# Altium schematic sheet [05] - Slow Control.SchDoc
size A3; Address1: III. Physikalisches Institut B; Address2: RWTH Aachen University; Address3: Otto-Blumenthal-Strasse; Address4: 52074 Aachen, GERMANY; DocumentNumber: 6; SheetNumber: 6; SheetTotal: 6
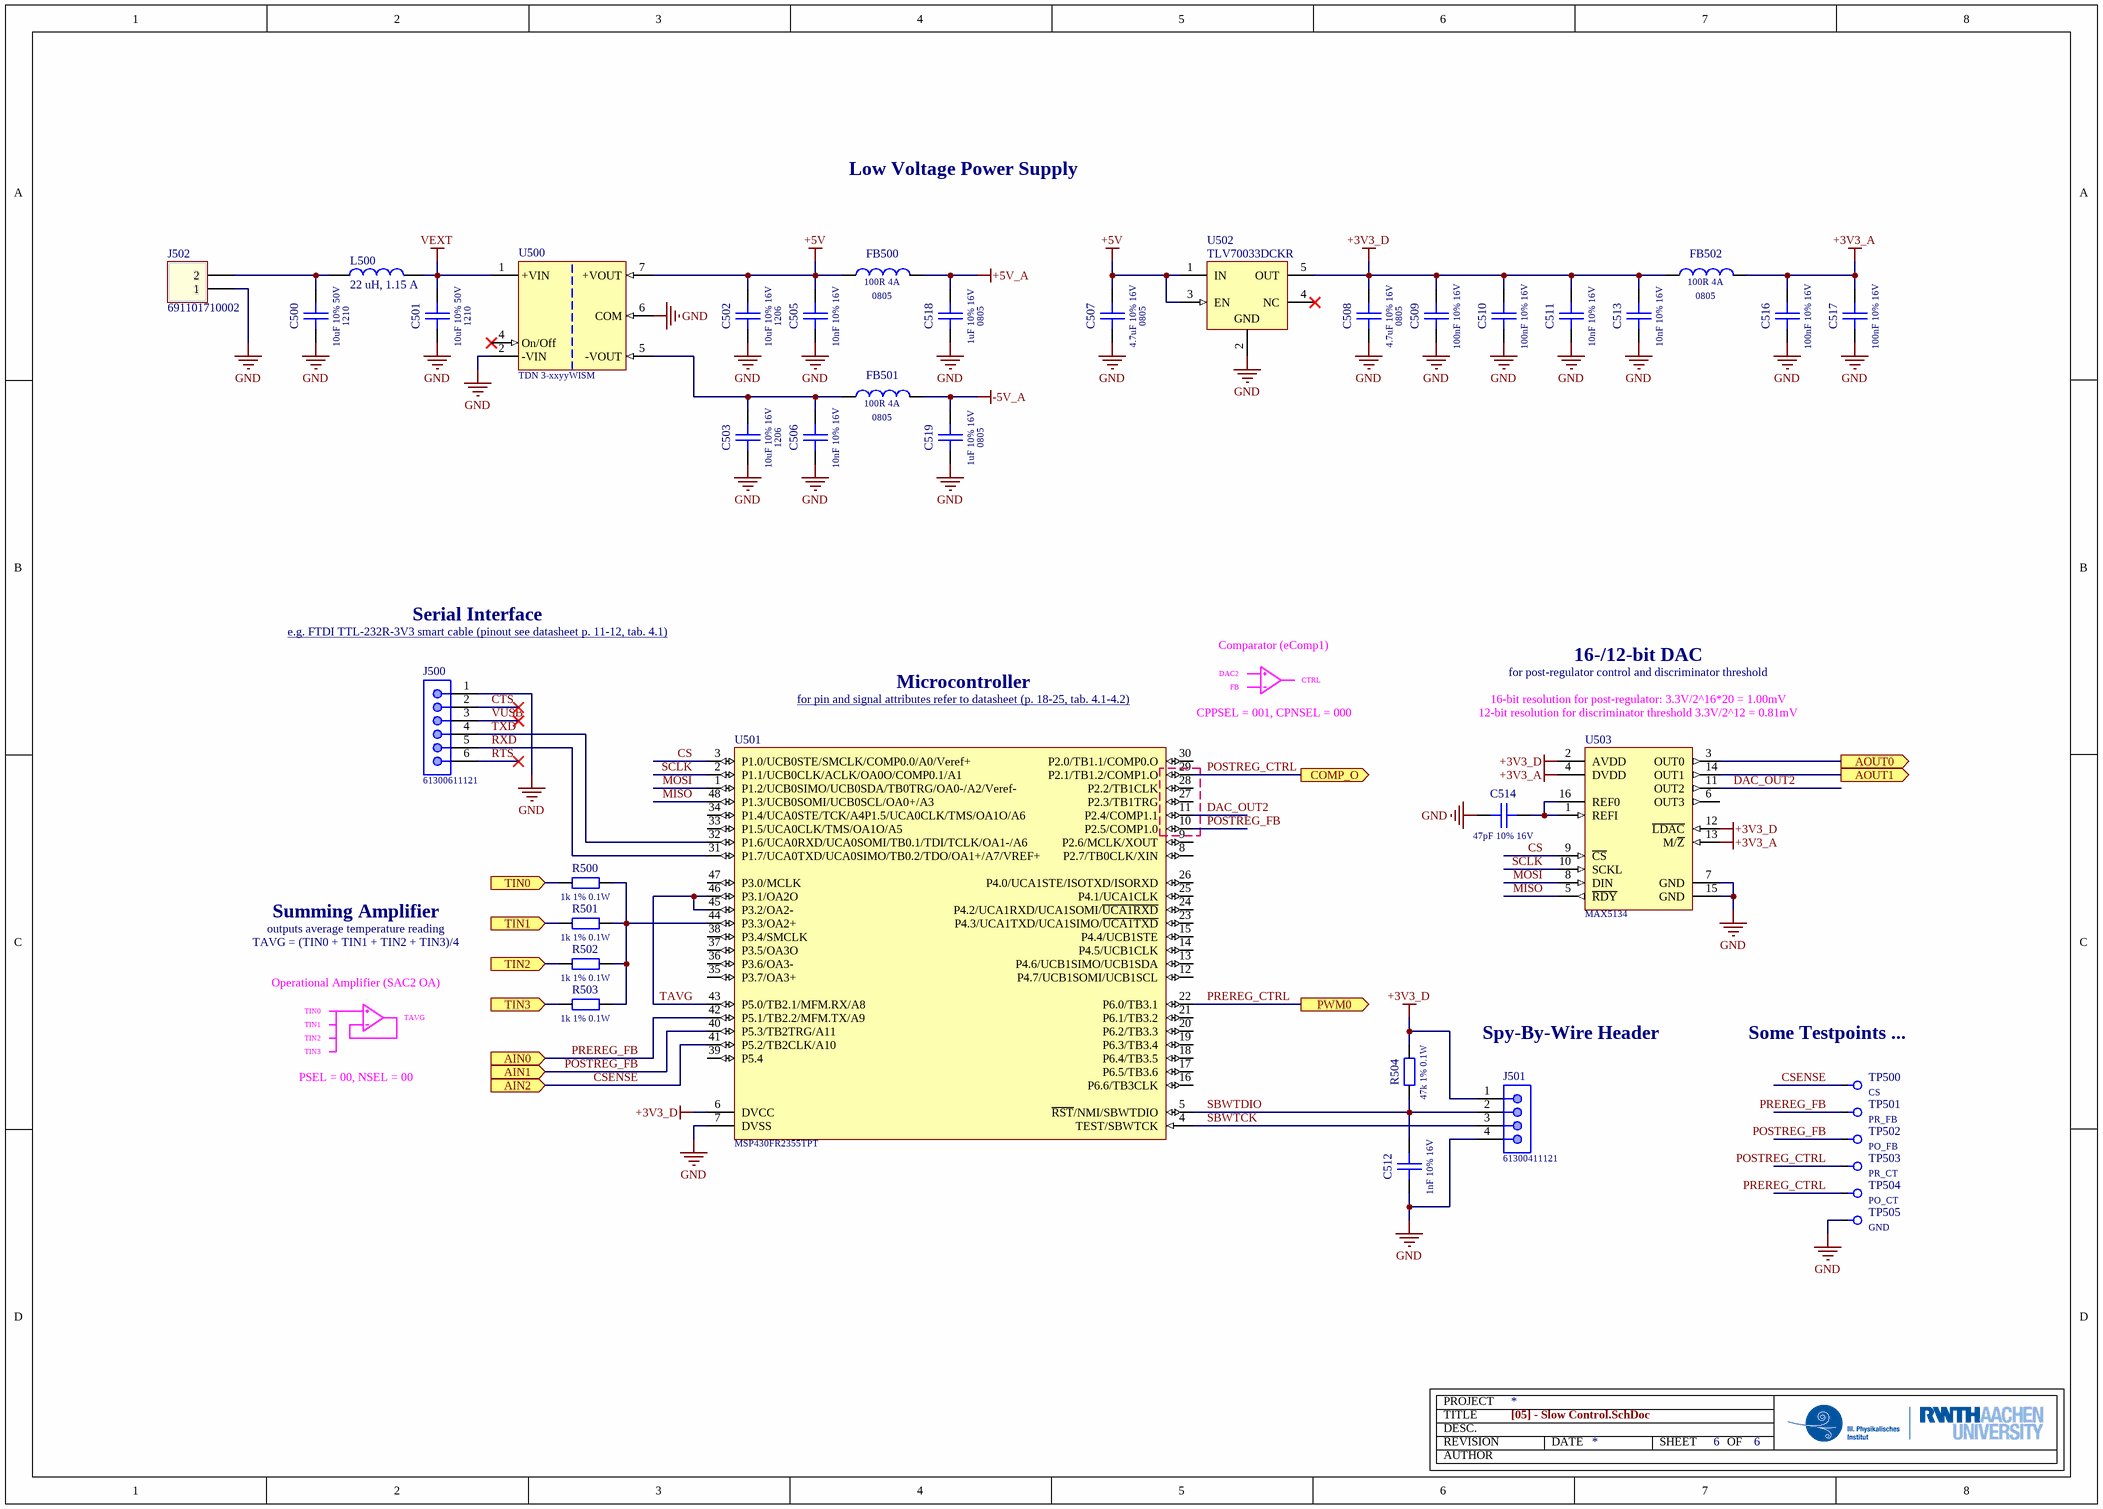
[diagram p0: [05] - Slow Control.SchDoc]

## Parts
C500  PackageReference: 1210  [1210_CAP]  (hidden comment: 10uF 10% 50V)
C501  PackageReference: 1210  [1210_CAP]  (hidden comment: 10uF 10% 50V)
C502  PackageReference: 1206  [1206_CAP]  (hidden comment: 10uF 10% 16V)
C503  PackageReference: 1206  [1206_CAP]  (hidden comment: 10uF 10% 16V)
C505  10nF 10% 16V  [0603_CAP]
C506  10nF 10% 16V  [0603_CAP]
C507  PackageReference: 0805  [0805_CAP]  (hidden comment: 4.7uF 10% 16V)
C508  PackageReference: 0805  [0805_CAP]  (hidden comment: 4.7uF 10% 16V)
C509  100nF 10% 16V  [0603_CAP]
C510  100nF 10% 16V  [0603_CAP]
C511  10nF 10% 16V  [0603_CAP]
C512  1nF 10% 16V  [0603_CAP]
C513  10nF 10% 16V  [0603_CAP]
C514  47pF 10% 16V  [0603_CAP]
C516  100nF 10% 16V  [0603_CAP]
C517  100nF 10% 16V  [0603_CAP]
C518  PackageReference: 0805  [0805_CAP]  (hidden comment: 1uF 10% 16V)
C519  PackageReference: 0805  [0805_CAP]  (hidden comment: 1uF 10% 16V)
FB500  PackageReference: 0805  [0805_RES]  (hidden comment: 100R 4A)
FB501  PackageReference: 0805  [0805_RES]  (hidden comment: 100R 4A)
FB502  PackageReference: 0805  [0603_RES]  (hidden comment: 100R 4A)
J500  61300611121  [61300611121]
J501  61300411121  [61300411121]
J502  691101710002  [691101710002]
L500  22 uH, 1.15 A  [WE-TPC_5828]
R500  1k 1% 0.1W  [0603_RES]
R501  1k 1% 0.1W  [0603_RES]
R502  1k 1% 0.1W  [0603_RES]
R503  1k 1% 0.1W  [0603_RES]
R504  47k 1% 0.1W  [0603_RES]
TP500  CS  [TESTPOINT_5019]
TP501  PR_FB  [TESTPOINT_5019]
TP502  PO_FB  [TESTPOINT_5019]
TP503  PR_CT  [TESTPOINT_5019]
TP504  PO_CT  [TESTPOINT_5019]
TP505  GND  [TESTPOINT_5019]
U500  TDN 3-xxyyWISM  [TDN_3WISM-PACK]
U501  MSP430FR2355TPT  [PQFP-48]
U502  TLV70033DCKR  [TI-DCK5_V]
U503  MAX5134  [TSSOP-16]

## Ports
AIN0 (in), AIN1 (in), AIN2 (in), AOUT0 (out), AOUT1 (out), COMP_O (out), PWM0 (out), TIN0 (in), TIN1 (in), TIN2 (in), TIN3 (in)

## Nets
+3V3_A: C516.2 C517.2 FB502.2 U503.4(DVDD) U503.13(M/~{Z})
+3V3_D: C508.2 C509.2 C510.2 C511.2 C513.2 FB502.1 J501.1 R504.1 U501.6(DVCC) U502.5(OUT) U503.2(AVDD) U503.12(~{LDAC})
+5V: C502.2 C505.2 C507.2 FB500.1 U500.7(+VOUT) U502.1(IN) U502.3(EN)
+5V_A: C518.2 FB500.2
-5V_A: C519.2 FB501.2
GND: C500.1 C501.1 C502.1 C503.1 C505.1 C506.1 C507.1 C508.1 C509.1 C510.1 C511.1 C512.1 C513.1 C514.1 C516.1 C517.1 C518.1 C519.1 J500.1 J501.4 J502.1 TP505.1 U500.2(-VIN) U500.6(COM) U501.7(DVSS) U502.2(GND) U503.7(GND) U503.15(GND)
VEXT: C501.2 L500.2 U500.1(+VIN)
AOUT0: U503.3(OUT0) ; port AOUT0
AOUT1: U503.14(OUT1) ; port AOUT1
~{CTS}: J500.2
CS: U501.3(P1.0/UCB0STE/SMCLK/COMP0.0/A0/Veref+) U503.9(~{CS})
CSENSE: TP500.1 U501.41(P5.2/TB2CLK/A10) ; port AIN2
DAC_OUT2: U501.11(P2.4/COMP1.1) U503.11(OUT2)
MISO: U501.48(P1.3/UCB0SOMI/UCB0SCL/OA0+/A3) U503.5(~{RDY})
MOSI: U501.1(P1.2/UCB0SIMO/UCB0SDA/TB0TRG/OA0-/A2/Veref-) U503.8(DIN)
POSTREG_CTRL: TP503.1 U501.29(P2.1/TB1.2/COMP1.O) ; port COMP_O
POSTREG_FB: TP502.1 U501.10(P2.5/COMP1.0) U501.40(P5.3/TB2TRG/A11) ; port AIN1
PREREG_CTRL: TP504.1 U501.22(P6.0/TB3.1) ; port PWM0
PREREG_FB: TP501.1 U501.42(P5.1/TB2.2/MFM.TX/A9) ; port AIN0
~{RTS}: J500.6
RXD: J500.5 U501.31(P1.7/UCA0TXD/UCA0SIMO/TB0.2/TDO/OA1+/A7/VREF+)
SBWTCK: J501.3 U501.4(TEST/SBWTCK)
SBWTDIO: C512.2 J501.2 R504.2 U501.5(~{RST}/NMI/SBWTDIO)
SCLK: U501.2(P1.1/UCB0CLK/ACLK/OA0O/COMP0.1/A1) U503.10(SCKL)
TAVG: U501.43(P5.0/TB2.1/MFM.RX/A8) U501.45(P3.2/OA2-) U501.46(P3.1/OA2O)
TIN0: R500.2 ; port TIN0
TIN1: R501.2 ; port TIN1
TIN2: R502.2 ; port TIN2
TIN3: R503.2 ; port TIN3
TXD: J500.4 U501.32(P1.6/UCA0RXD/UCA0SOMI/TB0.1/TDI/TCLK/OA1-/A6)
VUSB: J500.3
NetC500_2: C500.2 J502.2 L500.1
NetC503_2: C503.2 C506.2 FB501.1 U500.5(-VOUT)
NetC514_2: C514.2 U503.1(REFI) U503.16(REF0)
NetR500_1: R500.1 R501.1 R502.1 R503.1 U501.44(P3.3/OA2+)

Not connected (* = marked no-connect by the designer): U500 4(On/Off)*; U501 8(P2.7/TB0CLK/XIN) 9(P2.6/MCLK/XOUT) 12(P4.7/UCB1SOMI/UCB1SCL) 13(P4.6/UCB1SIMO/UCB1SDA) 14(P4.5/UCB1CLK) 15(P4.4/UCB1STE) 16(P6.6/TB3CLK) 17(P6.5/TB3.6) 18(P6.4/TB3.5) 19(P6.3/TB3.4) 20(P6.2/TB3.3) 21(P6.1/TB3.2) 23(P4.3/UCA1TXD/UCA1SIMO/~{UCA1TXD}) 24(P4.2/UCA1RXD/UCA1SOMI/~{UCA1RXD}) 25(P4.1/UCA1CLK) 26(P4.0/UCA1STE/ISOTXD/ISORXD) 27(P2.3/TB1TRG) 28(P2.2/TB1CLK) 30(P2.0/TB1.1/COMP0.O) 33(P1.5/UCA0CLK/TMS/OA1O/A5) 34(P1.4/UCA0STE/TCK/A4P1.5/UCA0CLK/TMS/OA1O/A6) 35(P3.7/OA3+) 36(P3.6/OA3-) 37(P3.5/OA3O) 38(P3.4/SMCLK) 39(P5.4) 47(P3.0/MCLK); U502 4(NC)*; U503 6(OUT3)

## Notes on the sheet
- Low Voltage Power Supply
- Serial Interface
- e.g. FTDI TTL-232R-3V3 smart cable (pinout see datasheet p. 11-12, tab. 4.1) <https://www.ftdichip.com/Support/Documents/DataSheets/Cables/DS_TTL-232R_CABLES.pdf>
- Comparator (eComp1)
- Microcontroller
- for pin and signal attributes refer to datasheet (p. 18-25, tab. 4.1-4.2) <https://www.ti.com/lit/ds/symlink/msp430fr2355.pdf?ts=1593776383476&ref_url=https%253A%252F%252Fwww.ti.com%252Fproduct%252FMSP430FR2355>
- DAC2
- FB
- (near U501) CPPSEL = 001, CPNSEL = 000
- CTRL
- 16-/12-bit DAC
- for post-regulator control and discriminator threshold
- 16-bit resolution for post-regulator: 3.3V/2^16*20 = 1.00mV
- (near U503) 12-bit resolution for discriminator threshold 3.3V/2^12 = 0.81mV
- Summing Amplifier
- outputs average temperature reading
- TAVG = (TIN0 + TIN1 + TIN2 + TIN3)/4
- Operational Amplifier (SAC2 OA)
- TIN0
- TIN1
- TIN2
- TIN3
- TAVG
- Spy-By-Wire Header
- (near TP500) Some Testpoints ...
- PSEL = 00, NSEL = 00
- TITLE
- REVISION
- PROJECT
- AUTHOR
- DESC.
- DATE
- SHEET
- OF

## Library data of the parts
C500-C503 C505-C514 C516-C519 = Capacitor: Simple generic capacitor.
  C500 C501: Value: 10uF 10% 50V
  C502 C503: Value: 10uF 10% 16V
  C505 C506 C511 C513: PackageReference: 0603; Value: 10nF 10% 16V
  C507 C508: Value: 4.7uF 10% 16V
  C509 C510 C516 C517: PackageReference: 0603; Value: 100nF 10% 16V
  C512: PackageReference: 0603; Value: 1nF 10% 16V
  C514: PackageReference: 0603; Value: 47pF 10% 16V
  C518 C519: Value: 1uF 10% 16V
FB500-FB502 = Inductor: Simple generic inductor.; Manufacturer: TDK; PartNumber: MPZ2012S101ATD25; Value: 100R 4A
J500 = 61300611121: WR-PHD Pin Header, THT, pitch 2.54mm, Single Row, Vertical, 6pin; Pin Number: 6; Gender: Male; Rated Current: 3A; Working Voltage: 250VAC; Withstanding Voltage: 500VAC; Contact Resistance: 20mOhm; ComponentLink1Description: Manufacturer; ComponentLink1URL: http://www.we-online.de; ComponentLink2Description: Datasheet; ComponentLink2URL: https://katalog.we-online.de/em/datasheet/6130xx11121.pdf; Part Number: 61300611121; Published Date: June 2019; Publisher: Wurth Elektronik; Pitch: 2.54mm; Operating Temperature: -40 to +105degC; Mounting Technology: THT; Packaging: Bag; Row Number: Single; Orientation: Vertical
J501 = 61300411121: WR-PHD Pin Header, THT, pitch 2.54mm, Single Row, Vertical, 4pin; Pin Number: 4; Gender: Male; Rated Current: 3A; Working Voltage: 250VAC; Withstanding Voltage: 500VAC; Contact Resistance: 20mOhm; ComponentLink1Description: Manufacturer; ComponentLink1URL: http://www.we-online.de; ComponentLink2Description: Datasheet; ComponentLink2URL: https://katalog.we-online.de/em/datasheet/6130xx11121.pdf; Part Number: 61300411121; Published Date: June 2019; Publisher: Wurth Elektronik; Pitch: 2.54mm; Operating Temperature: -40 to +105degC; Mounting Technology: THT; Packaging: Bag; Row Number: Single; Orientation: Vertical
J502 = 691101710002: WR-TBL Serie 101 - 5.00 mm Horizontal Entry Modular, 02p; Pitch: 5 mm; ComponentLink1Description: Manufacturer; ComponentLink1URL: http://www.we-online.de; ComponentLink2Description: Datasheet; ComponentLink2URL: http://katalog.we-online.de/em/datasheet/6911017100xx.pdf; Part Number: 691101710002; Published Date: Feb. 2017; Publisher: Wurth Elektronik; Pin Number: 02p
L500 = 744053220: SMT Shielded Tiny Power Inductor WE-TPC, size 5828, 22 uH, 1.15 A; Rated Current: 1.15 A; Inductance: 22 uH; DC Resistance max.: 120 mOhm; Self Resonant Frequency: 20 MHz; Saturation Current: 0.9 A; ComponentLink1Description: Manufacturer; ComponentLink1URL: http://www.we-online.de; ComponentLink2Description: Datasheet; ComponentLink2URL: https://katalog.we-online.com/pbs/datasheet/744053220.pdf; Part Number: 744053220; Published Date: December 2018; Publisher: Wurth Elektronik; PackageReference: 5828; Operating Temperature: -40 to +125 degC; Mounting Technology: SMT; Packaging: Tape and Reel
R500-R504 = Resistor: Simple generic resistor.; PackageReference: 0603
  R500-R503: Value: 1k 1% 0.1W
  R504: Value: 47k 1% 0.1W
TP500-TP505 = Testpoint: Red PC Test Point, Miniature Phosphor Bronze, Silver Plating 0.040" (1.02mm) Hole Diameter Mounting Type.; Manufacturer: Keystone Electronics; PartNumber: 500X; PackageReference: Test Point
  TP500: Value: CS
  TP501: Value: PR_FB
  TP502: Value: PO_FB
  TP503: Value: PR_CT
  TP504: Value: PO_CT
  TP505: Value: GND
U500 = _BLANK_1: TDN 3WISM Series, 3 Watt DC/DC converter.; Manufacturer: Traco Power; PackageReference: TDN-3-Pack; Value: TDN 3-xxyyWISM
U501 = MSP430FR2355TPT: Mixed-Signal Microcontroller.; Manufacturer: Texas Instruments; PackageReference: LQFP-48; PartNumber: MSP430FR2355TPT; Supplier1: Mouser; Supplier1Link: https://www.mouser.de/ProductDetail/Texas-Instruments/MSP430FR2355TPT?qs=sGAEpiMZZMsp%252Bcahb6g%252BW1GHiEy7RoiAFs9DV1sKylCWNRvNatvbuQ%3D%3D; Supplier1PartNumber: 595-MSP430FR2355TPT; Value: MSP430FR2355TPT
U502 = TLV70033DCKR: Single Output LDO, 200 mA, Fixed 3.3 V Output, 2 to 5.5 V Input, with Low IQ, 5-pin SC70 (DCK), -40 to 125 degC, Green (RoHS & no Sb/Br); Manufacturer: Texas Instruments; Accuracy(%): 2; Fixed Output Options(V): 3.3; Iout(Max)(A): 0.2; Iq(Typ)(mA): 0.03; SubFamily: Single Channel LDO; Vdo(Typ)(mV): 175; Vin(Max)(V): 5.5; DatasheetVersion: SLVSA00D; PackageVersion: 4093553-3/G; PackageReference: DCK5; PackageDescription: 5-Pin Plastic Small-Outline, Body 2 x 1.25 mm, Pitch 0.65 mm; Supplier 1: Digi-Key; Supplier Part Number 1: 296-32413-2-ND; Supplier 2: Digi-Key; Supplier Part Number 2: 296-32413-1-ND; Supplier 3: Digi-Key; Supplier Part Number 3: 296-32413-6-ND; Supplier 4: Newark; Supplier Part Number 4: 55R7467; Supplier 5: Mouser; Supplier Part Number 5: 595-TLV70033DCKR; Eco-Plan: Green (RoHS & no Sb/Br); Vin(Min)(V): 2; Vout Adj(Max)(V): 3.3; Vout Adj(Min)(V): 3.3; Mounting Technology: Surface Mount; Code_JEDEC: MO-203; PartNumber: TLV70033DCKR; ComponentLink1Description: Manufacturer URL; ComponentLink1URL: http://www.ti.com/; ComponentLink2Description: Datasheet; ComponentLink2URL: http://www.ti.com/general/docs/lit/getliterature.tsp?genericPartNumber=TLV70033&fileType=pdf; ComponentLink3Description: Package Specification; ComponentLink3URL: http://www.ti.com/litv/pdf/mpds025f
U503 = MAX5134: Pin-/Software-Compatible, 16-/12-Bit, Voltage-Output DACs.; Manufacturer: Maxim Integrated; PartNumber: MAX5134AGUE+; PackageReference: TSSOP-16; Supplier1: RS-Components; Supplier1PartNumber: 190-5093; Supplier1Link: https://de.rs-online.com/web/p/d-a-wandler/1905093/; ComponentLink1Description: New link; ComponentLink1URL: *; Value: MAX5134